# EAGLE board marbles_v70 (EAGLE 9.6.2)
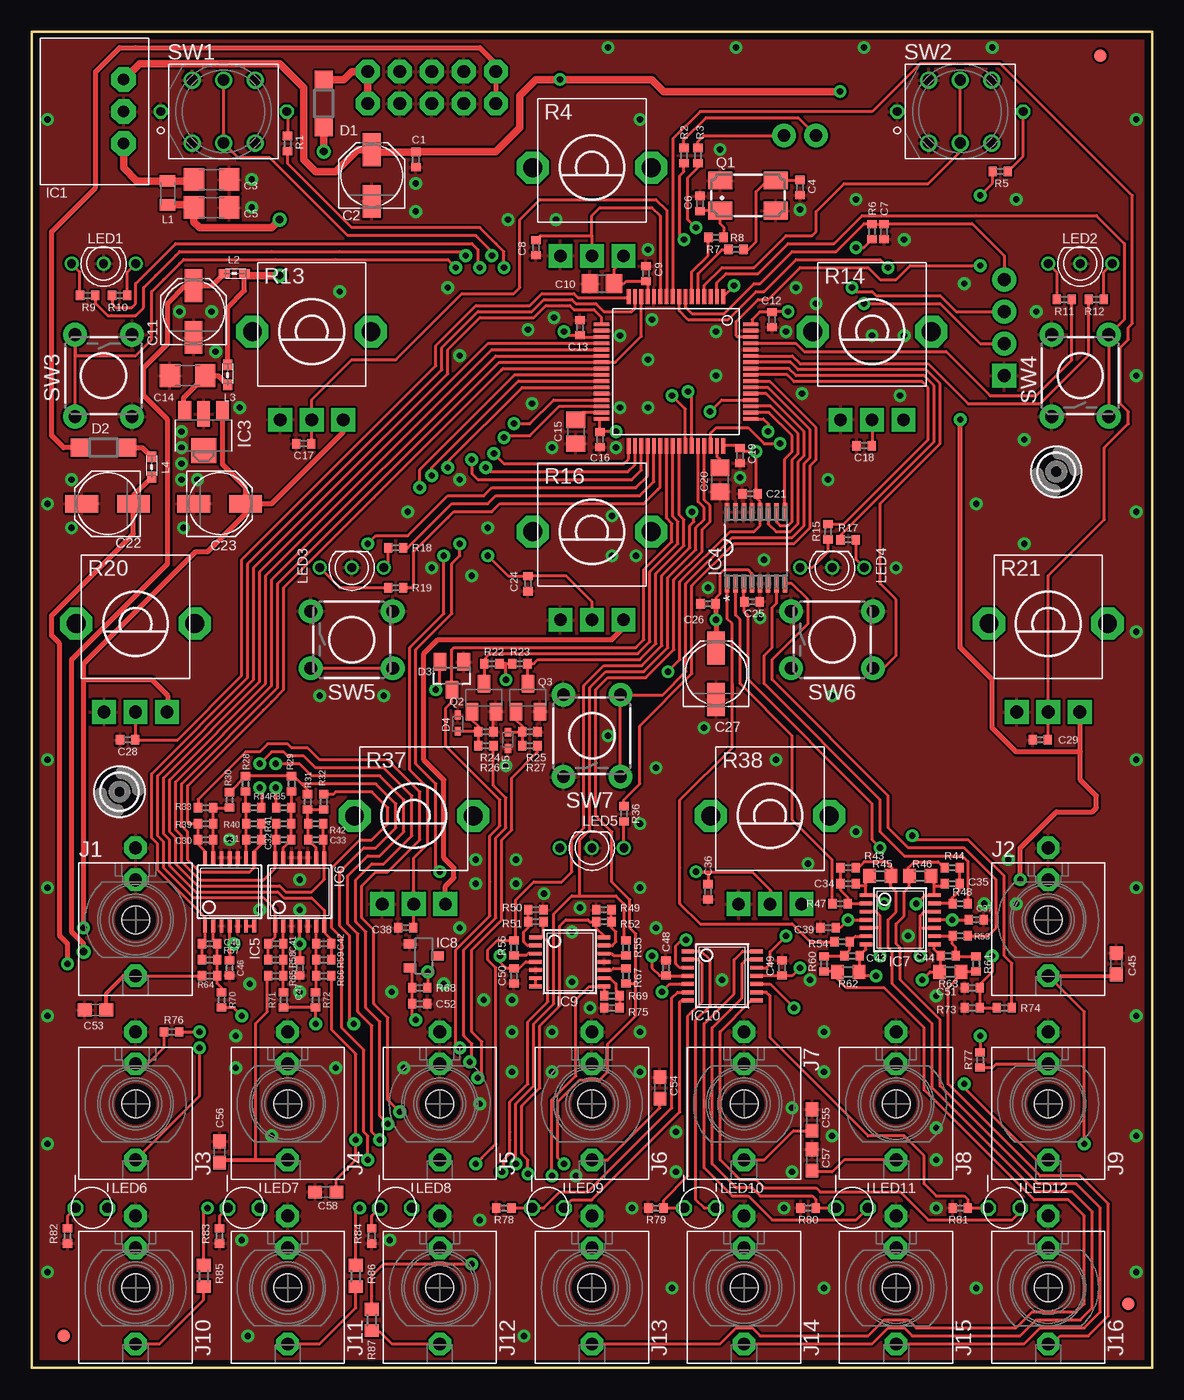
[diagram p5: board, top side]
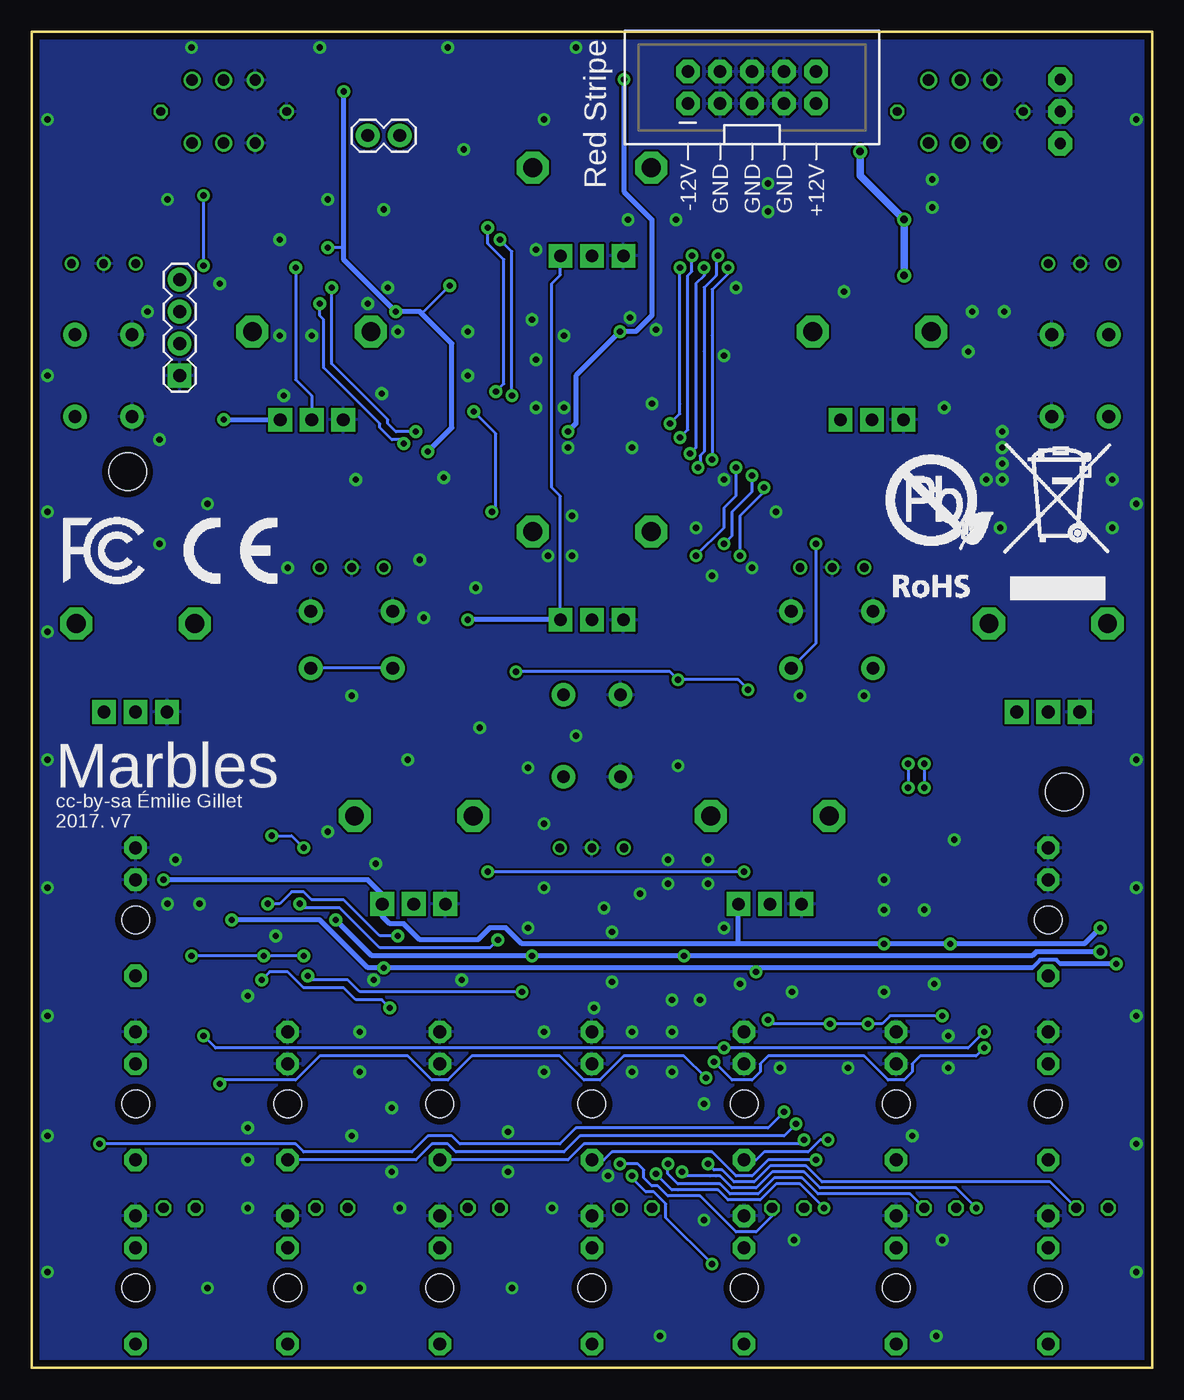
[diagram p6: board, bottom side, seen from below]

Size 88.9 x 106.05 mm. Coordinates in mm from the lower left corner, seen from the top.
Outline: 0,0 88.9,0 88.9,106.05 0,106.05 0,0
Copper layers (1*16): Top 0.035mm / dielectric 1.5mm / Bottom 0.035mm
Design rules "PCBCart-Standard-Fine": minimum track width 8mil, minimum drill 0.4mm, track to track 7mil, track to pad 7mil, pad to pad 7mil, via to via 7mil, smd to smd 7mil, copper to edge 20mil, drill to drill 8mil, minimum pad ring 8mil, minimum via ring 10mil, stop-mask expansion 3mil, vias tented up to drill 25mil, thermal gap 8mil

## Footprints (pad centres in the part's own frame; a part is rotated, then mirrored left to right if it is on the bottom)
C0402 = smd 0.65 x 0.75: 1 -0.6,0; 2 0.6,0
PANASONIC_C = smd 2.6 x 1.4: + 2.05,0; - -2.05,0
C1206 = smd 1.6 x 1.8: 1 -1.4,0; 2 1.4,0
C0805 = smd 1.3 x 1.5: 1 -0.95,0; 2 0.95,0
C0603 = smd 1.1 x 1: 1 -0.85,0; 2 0.85,0
SOD123 = smd 1.4 x 1.4: A 1.9,0; C -1.9,0
SOT23 = smd 1 x 1.4: 1 -0.95,-1.1; 2 0.95,-1.1; 3 0,1.1
SOD523 = smd 0.7 x 0.5: A 0.7,0; C -0.6,0
FIDUCIAL-1X2 = smd 1 x 1: 1 0,0
3,0TINY = hole 3: 0,0
WE78 = drill 0.9 pad 1.93 octagon: 1 -2.54,0; 2 0,0; 3 2.54,0
TQFP-10X10-64 = smd 1.2 x 0.3: 1 -5.936,3.75; 2 -5.936,3.25; 3 -5.936,2.75; 4 -5.936,2.25; 5 -5.936,1.75; 6 -5.936,1.25; 7 -5.936,0.75; 8 -5.936,0.25; 9 -5.936,-0.25; 10 -5.936,-0.75; 11 -5.936,-1.25; 12 -5.936,-1.75; 13 -5.936,-2.25; 14 -5.936,-2.75; 15 -5.936,-3.25; 16 -5.936,-3.75; 33 5.886,-3.75; 34 5.886,-3.25; 35 5.886,-2.75; 36 5.886,-2.25; 37 5.886,-1.75; 38 5.886,-1.25; 39 5.886,-0.75; 40 5.886,-0.25; 41 5.886,0.25; 42 5.886,0.75; 43 5.886,1.25; 44 5.886,1.75; 45 5.886,2.25; 46 5.886,2.75; 47 5.886,3.25; 48 5.886,3.75 | smd 0.3 x 1.2: 17 -3.75,-5.911; 18 -3.25,-5.911; 19 -2.75,-5.911; 20 -2.25,-5.911; 21 -1.75,-5.911; 22 -1.25,-5.911; 23 -0.75,-5.911; 24 -0.25,-5.911; 25 0.25,-5.911; 26 0.75,-5.911; 27 1.25,-5.911; 28 1.75,-5.911; 29 2.25,-5.911; 30 2.75,-5.911; 31 3.25,-5.911; 32 3.75,-5.911; 49 3.75,5.936; 50 3.25,5.936; 51 2.75,5.936; 52 2.25,5.936; 53 1.75,5.936; 54 1.25,5.936; 55 0.75,5.936; 56 0.25,5.936; 57 -0.25,5.936; 58 -0.75,5.936; 59 -1.25,5.936; 60 -1.75,5.936; 61 -2.25,5.936; 62 -2.75,5.936; 63 -3.25,5.936; 64 -3.75,5.936
SOT89 = smd 1 x 1.5: 1 -1.499,-1.981; 3 1.499,-1.981 | smd 1 x 2: 2 0,-1.727 | smd 2 x 2: 2@1 0,1.194
SOP65P640X110-16N = smd 1.422 x 0.356: 1 -2.845,2.286; 2 -2.845,1.626; 3 -2.845,0.965; 4 -2.845,0.33; 5 -2.845,-0.33; 6 -2.845,-0.965; 7 -2.845,-1.626; 8 -2.845,-2.286; 9 2.845,-2.286; 10 2.845,-1.626; 11 2.845,-0.965; 12 2.845,-0.33; 13 2.845,0.33; 14 2.845,0.965; 15 2.845,1.626; 16 2.845,2.286
TSSOP14_065 = smd 0.305 x 0.991: 1 -1.95,-2.718; 2 -1.3,-2.718; 3 -0.65,-2.718; 4 0,-2.718; 5 0.65,-2.718; 6 1.3,-2.718; 7 1.95,-2.718; 8 1.95,2.718; 9 1.3,2.718; 10 0.65,2.718; 11 0,2.718; 12 -0.65,2.718; 13 -1.3,2.718; 14 -1.95,2.718
DBZ_R-PDSO-G3 = smd 0.7 x 1: 1 -0.95,-1.1; 2 0.95,-1.1; 3 0,1.1
WQP_PJ_301M6 = drill 1.016 pad 1.778 octagon: P1 0,-5.715; P2 0,-3.175; P3 0,4.445 | hole 2.2: 0,0
1X04 = drill 1.016 pad 1.88 square: 1 0,0 | drill 1.016 pad 1.88: 2 2.54,0; 3 5.08,0; 4 7.62,0
1X02 = drill 1.016 pad 1.88: 1 0,0; 2 2.54,0
2X5-SHROUDED = drill 1.016 pad 1.88 octagon: 1 -1.27,5.08; 2 1.27,5.08; 3 -1.27,2.54; 4 1.27,2.54; 5 -1.27,0; 6 1.27,0; 7 -1.27,-2.54; 8 1.27,-2.54; 9 -1.27,-5.08; 10 1.27,-5.08
L2012C = smd 0.9 x 1.25: 1 -0.9,0; 2 1,0
0603 = smd 0.85 x 0.7: 1 -0.9,0; 2 0.7,0
LED-BICOLOR-THROUGHHOLE-2.54 = drill 0.7: 1 -2.54,0; 2 0,0; 3 2.54,0
LED3MM = drill 0.813 octagon: 1 -1.27,0; 2 1.27,0
CTS406 = smd 1.9 x 1.4: 1 -2.2,-1.2; 2 2.2,-1.2; 3 2.2,1.2; 4 -2.2,1.2
SOT23-BEC = smd 1 x 1.4: B -0.95,-1.1; C 0,1.1; E 0.95,-1.1
R0402 = smd 0.65 x 0.75: 1 -0.6,0; 2 0.6,0
ALPS_POT_VERTICAL_PS = drill 1 pad 1.88 square: P$1 -2.5,7; P$2 0,7; P$3 2.5,7 | drill 1.5 pad 2.54 octagon: P$4 -4.7,0; P$5 4.7,0
R0603 = smd 1 x 1.1: 1 -0.85,0; 2 0.85,0
LP4OA1PBCT = drill 0.7 octagon: L1 5,0; L2 -5,0 | drill 0.9: P1 2.5,2.5; P2 0,2.5; P3 -2.5,2.5; P4 2.5,-2.5; P5 0,-2.5; P6 -2.5,-2.5
TACTILE-PTH = drill 1.016 pad 1.88: 1 -3.251,2.261; 2 3.251,2.261; 3 -3.251,-2.261; 4 3.251,-2.261

## Placement (x,y rotation side)
C1  100n  [C0402]  30.48,95.89 270 top
C2  22u  [PANASONIC_C]  26.99,94.61 90 top
C3  22u  [C1206]  14.29,94.3 0 top
C4  20p  [C0402]  60.96,93.66 90 top
C5  22u  [C1206]  14.29,92.08 0 top
C6  20p  [C0402]  53.02,92.39 270 top
C7  100n  [C0402]  67.63,90.17 270 top
C8  100n  [C0402]  40.01,88.9 270 top
C9  100n  [C0402]  48.74,86.84 90 top
C10  2.2u  [C0805]  45.24,86.04 180 top
C11  22u  [PANASONIC_C]  12.86,83.82 90 top
C12  100n  [C0402]  58.74,83.19 270 top
C13  100n  [C0402]  43.5,82.55 90 top
C14  22u  [C1206]  12.38,78.74 180 top
C15  2.2u  [C0805]  43.18,74.3 270 top
C16  100n  [C0402]  45.09,73.66 270 top
C17  100n  [C0402]  21.59,73.34 180 top
C18  100n  [C0402]  66.04,73.18 180 top
C19  100n  [C0402]  56.2,72.39 270 top
C20  2.2u  [C0805]  54.61,70.48 270 top
C21  100n  [C0402]  56.99,69.37 180 top
C22  22u  [PANASONIC_C]  6.03,68.58 180 top
C23  22u  [PANASONIC_C]  14.92,68.58 0 top
C24  100n  [C0402]  39.37,62.23 270 top
C25  470n  [C0402]  57.15,60.8 0 top
C26  100n  [C0402]  53.66,60.64 180 top
C27  22u  [PANASONIC_C]  54.29,55.09 90 top
C28  100n  [C0402]  7.62,49.85 180 top
C29  100n  [C0402]  80.01,49.85 180 top
C30  4.7n  [C0402]  13.81,41.91 180 top
C31  470p  [C0402]  17.62,41.91 0 top
C32  4.7n  [C0402]  20,41.91 180 top
C33  4.7n  [C0402]  22.54,41.91 0 top
C34  47p  [C0402]  64.77,38.42 0 top
C35  47p  [C0402]  73.03,38.42 180 top
C36  100n  [C0402]  53.66,37.78 270 top
C37  100n  [C0402]  74.93,35.56 180 top
C38  100n  [C0402]  29.69,34.92 180 top
C39  100n  [C0402]  63.18,34.92 180 top
C40  4.7n  [C0402]  14.13,33.66 180 top
C41  470p  [C0402]  19.37,33.66 180 top
C42  4.7n  [C0402]  23.18,33.66 0 top
C43  47p  [C0402]  65.09,32.7 0 top
C44  47p  [C0402]  72.71,32.7 180 top
C45  ESD  [C0603]  86.04,32.07 90 top
C46  100n  [C0402]  15.72,31.75 270 top
C47  100n  [C0402]  21.27,31.75 270 top
C48  100n  [C0402]  50.32,31.75 90 top
C49  100n  [C0402]  59.53,31.75 270 top
C50  100n  [C0402]  38.26,31.12 270 top
C51  470n  [C0402]  74.61,30.16 180 top
C52  470n  [C0402]  30.8,28.89 0 top
C53  ESD  [C0603]  5.08,28.42 180 top
C54  ESD  [C0603]  49.85,22.23 90 top
C55  ESD  [C0603]  61.91,19.68 90 top
C56  ESD  [C0603]  14.92,17.14 90 top
C57  ESD  [C0603]  61.91,16.51 90 top
C58  ESD  [C0603]  23.34,13.97 180 top
D1  1N5819HW  [SOD123]  23.18,100.33 90 top
D2  1N5819HW  [SOD123]  5.71,73.03 0 top
D3  BAT54S  [SOT23]  33.34,54.93 180 top
D4  1N4148  [SOD523]  33.81,51.12 90 top
D5  1N4148  [SOD523]  37.78,49.85 270 top
F1  FIDUCIAL1X2  [FIDUCIAL-1X2]  84.77,104.14 0 top
F2  FIDUCIAL1X2  [FIDUCIAL-1X2]  87,5.08 0 top
F3  FIDUCIAL1X2  [FIDUCIAL-1X2]  2.54,2.54 0 top
H3  MOUNT-HOLE3.0TINY  [3,0TINY]  81.28,71.12 0 top
H5  MOUNT-HOLE3.0TINY  [3,0TINY]  6.99,45.72 0 top
IC1  R-78E3.3-0.5  [WE78]  7.3,99.69 90 top
IC2  STM32F405RGT6  [TQFP-10X10-64]  51.12,79.06 270 top
IC3  LD2981ABU33  [SOT89]  13.65,73.98 180 top
IC4  DAC8164ICPW  [SOP65P640X110-16N]  57.47,65.09 90 top
IC5  MCP6004  [TSSOP14_065]  15.72,37.78 0 top
IC6  MCP6004  [TSSOP14_065]  21.27,37.78 0 top
IC7  OPA4171  [TSSOP14_065]  68.9,35.56 270 top
IC8  LM4040B10  [DBZ_R-PDSO-G3]  31.11,32.7 270 top
IC9  LM324PW  [TSSOP14_065]  42.7,32.23 270 top
IC10  TL074PW  [TSSOP14_065]  54.77,31.11 270 top
J1  PJ301_THONKICONN6  [WQP_PJ_301M6]  8.26,35.56 180 top
J2  PJ301_THONKICONN6  [WQP_PJ_301M6]  80.64,35.56 180 top
J3  PJ301_THONKICONN6  [WQP_PJ_301M6]  8.26,20.95 180 top
J4  PJ301_THONKICONN6  [WQP_PJ_301M6]  20.32,20.95 180 top
J5  PJ301_THONKICONN6  [WQP_PJ_301M6]  32.38,20.95 180 top
J6  PJ301_THONKICONN6  [WQP_PJ_301M6]  44.45,20.95 180 top
J7  PJ301_THONKICONN6  [WQP_PJ_301M6]  56.52,20.95 180 top
J8  PJ301_THONKICONN6  [WQP_PJ_301M6]  68.58,20.95 180 top
J9  PJ301_THONKICONN6  [WQP_PJ_301M6]  80.64,20.95 180 top
J10  PJ301_THONKICONN6  [WQP_PJ_301M6]  8.26,6.35 180 top
J11  PJ301_THONKICONN6  [WQP_PJ_301M6]  20.32,6.35 180 top
J12  PJ301_THONKICONN6  [WQP_PJ_301M6]  32.38,6.35 180 top
J13  PJ301_THONKICONN6  [WQP_PJ_301M6]  44.45,6.35 180 top
J14  PJ301_THONKICONN6  [WQP_PJ_301M6]  56.52,6.35 180 top
J15  PJ301_THONKICONN6  [WQP_PJ_301M6]  68.58,6.35 180 top
J16  PJ301_THONKICONN6  [WQP_PJ_301M6]  80.64,6.35 180 top
JP1  [1X04]  77.15,78.74 90 bottom
JP2  [1X02]  59.69,97.79 180 bottom
JP4  M05X2SHD  [2X5-SHROUDED]  31.75,101.6 90 bottom
L1  33u  [L2012C]  10.79,93.19 90 top
L2  [0603]  16.19,86.84 0 top
L3  [0603]  15.56,78.9 90 top
L4  [0603]  9.53,71.6 90 top
LED1  W115WSURKMGKW  [LED-BICOLOR-THROUGHHOLE-2.54]  5.71,87.63 180 top
LED2  W115WSURKMGKW  [LED-BICOLOR-THROUGHHOLE-2.54]  83.19,87.63 180 top
LED3  W115WSURKMGKW  [LED-BICOLOR-THROUGHHOLE-2.54]  25.4,63.5 180 top
LED4  W115WSURKMGKW  [LED-BICOLOR-THROUGHHOLE-2.54]  63.5,63.5 180 top
LED5  W115WSURKMGKW  [LED-BICOLOR-THROUGHHOLE-2.54]  44.45,41.27 180 top
LED6  WP937EGW  [LED3MM]  4.76,12.7 180 top
LED7  WP937EGW  [LED3MM]  16.83,12.7 180 top
LED8  WP937EGW  [LED3MM]  28.89,12.7 180 top
LED9  WP937EGW  [LED3MM]  40.96,12.7 180 top
LED10  WP937EGW  [LED3MM]  53.02,12.7 180 top
LED11  WP937EGW  [LED3MM]  65.09,12.7 180 top
LED12  WP937EGW  [LED3MM]  77.15,12.7 180 top
Q1  8MHz  [CTS406]  56.83,93.03 0 top
Q2  MMBT3904  [SOT23-BEC]  35.88,53.18 0 top
Q3  MMBT3904  [SOT23-BEC]  39.37,53.18 0 top
R1  39  [R0402]  20.32,97.16 90 top
R2  100  [R0402]  51.75,96.2 270 top
R3  100  [R0402]  52.86,96.2 270 top
R4  10kB  [ALPS_POT_VERTICAL_PS]  44.45,95.25 180 top
R5  39  [R0402]  76.83,94.93 0 top
R6  10k  [R0402]  66.67,90.17 270 top
R7  100  [R0402]  54.29,89.69 0 top
R8  100  [R0402]  55.88,88.74 0 top
R9  2.2k  [R0402]  4.45,85.09 180 top
R10  1.5k  [R0402]  6.99,85.09 0 top
R11  2.2k  [R0402]  81.92,84.77 180 top
R12  1.5k  [R0402]  84.45,84.77 0 top
R13  10kB  [ALPS_POT_VERTICAL_PS]  22.23,82.23 180 top
R14  10kB  [ALPS_POT_VERTICAL_PS]  66.67,82.23 180 top
R15  2.2k  [R0402]  63.18,66.36 270 top
R16  10kB  [ALPS_POT_VERTICAL_PS]  44.45,66.36 180 top
R17  1.5k  [R0402]  64.77,65.72 0 top
R18  1.5k  [R0402]  28.89,65.09 180 top
R19  2.2k  [R0402]  28.89,61.91 180 top
R20  10kB  [ALPS_POT_VERTICAL_PS]  8.26,59.05 180 top
R21  10kB  [ALPS_POT_VERTICAL_PS]  80.64,59.05 180 top
R22  10k  [R0402]  36.51,55.88 0 top
R23  10k  [R0402]  38.74,55.88 180 top
R24  100k  [R0402]  36.04,50.48 180 top
R25  100k  [R0402]  39.53,50.48 180 top
R26  100k  [R0402]  36.04,49.37 180 top
R27  100k  [R0402]  39.53,49.37 180 top
R28  200k  [R0402]  16.99,46.35 90 top
R29  200k  [R0402]  20.64,46.35 90 top
R30  200k  [R0402]  15.72,45.09 90 top
R31  200k  [R0402]  21.91,44.93 90 top
R32  100k  [R0402]  23.18,44.93 90 top
R33  100k  [R0402]  13.81,44.45 180 top
R34  100k  [R0402]  17.62,44.45 0 top
R35  100k  [R0402]  20,44.45 180 top
R36  1.5k  [R0402]  46.99,43.97 270 top
R37  10kB  [ALPS_POT_VERTICAL_PS]  30.32,43.81 180 top
R38  10kB  [ALPS_POT_VERTICAL_PS]  58.58,43.81 180 top
R39  33k  [R0402]  13.81,43.18 0 top
R40  33k  [R0402]  17.62,43.18 180 top
R41  33k  [R0402]  20,43.18 0 top
R42  33k  [R0402]  22.54,43.18 180 top
R43  100k  [R0402]  64.77,39.69 180 top
R44  100k  [R0402]  73.02,39.69 0 top
R45  1.0k  [R0603]  67.31,39.05 180 top
R46  1.0k  [R0603]  70.48,39.05 0 top
R47  23.7k  [R0402]  64.14,36.83 180 top
R48  23.7k  [R0402]  73.66,36.83 0 top
R49  39k  [R0402]  45.4,36.35 180 top
R50  39k  [R0402]  40.01,36.35 0 top
R51  56k  [R0402]  40.01,35.4 180 top
R52  56k  [R0402]  45.4,35.4 0 top
R53  23.7k  [R0402]  73.66,34.29 0 top
R54  23.7k  [R0402]  64.29,33.81 180 top
R55  10k  [R0402]  47.15,33.34 90 top
R56  10k  [R0402]  38.26,33.34 90 top
R57  33k  [R0402]  14.13,32.38 0 top
R58  33k  [R0402]  19.37,32.38 0 top
R59  33k  [R0402]  23.18,32.38 180 top
R60  100k  [R0402]  62.87,32.07 90 top
R61  100k  [R0402]  74.93,32.07 90 top
R62  1.0k  [R0603]  64.77,31.43 0 top
R63  1.0k  [R0603]  72.87,31.43 180 top
R64  100k  [R0402]  14.13,31.11 180 top
R65  100k  [R0402]  19.37,31.11 180 top
R66  100k  [R0402]  23.18,31.11 0 top
R67  10k  [R0402]  47.15,31.11 270 top
R68  1.0k  [R0402]  30.8,30.16 180 top
R69  56k  [R0402]  46.04,29.53 0 top
R70  200k  [R0402]  15.08,29.21 270 top
R71  200k  [R0402]  20,29.21 270 top
R72  200k  [R0402]  22.54,29.21 270 top
R73  100k  [R0402]  74.61,28.57 0 top
R74  150k  [R0402]  77.15,28.57 0 top
R75  39k  [R0402]  46.04,28.57 180 top
R76  100k  [R0402]  11.11,26.67 180 top
R77  100k  [R0402]  75.25,24.45 270 top
R78  680  [R0402]  37.47,12.7 180 top
R79  680  [R0402]  49.53,12.7 180 top
R80  680  [R0402]  61.59,12.7 180 top
R81  680  [R0402]  73.66,12.7 180 top
R82  180  [R0402]  2.86,10.48 90 top
R83  180  [R0402]  14.92,10.48 90 top
R84  180  [R0402]  26.99,10.48 90 top
R85  1.0k  [R0603]  13.65,7.3 90 top
R86  1.0k  [R0603]  25.72,7.3 90 top
R87  1.0k  [R0603]  26.99,3.81 90 top
SW1  LP4OA1PBCT  [LP4OA1PBCT]  15.24,99.69 0 top
SW2  LP4OA1PBCT  [LP4OA1PBCT]  73.66,99.69 0 top
SW3  [TACTILE-PTH]  5.71,78.74 270 top
SW4  [TACTILE-PTH]  83.19,78.74 90 top
SW5  [TACTILE-PTH]  25.4,57.78 0 top
SW6  [TACTILE-PTH]  63.5,57.78 0 top
SW7  [TACTILE-PTH]  44.45,50.16 90 top
U$2  [ROHS_BIG]  22.38,60.17 0 bottom
U$4  [CE_MEDIUM]  76.83,62.23 0 bottom
U$5  [FCC_MEDIUM]  86.36,62.23 0 bottom

## Tracks (layer width: path | path; a pad name or v marks a point on that pad's centre or on a via)
+3V3  (via drill 0.5)
  Top 0.254: IC2.64 57.15,82.9 57.15,83.19 57.75,83.78 C12.1 58.77,83.82 v60.01,83.82 | v46.35,74.3 45.12,74.3 C16.1 45.09,75.19 IC2.32 | IC2.1 55.72,85.85 v55.72,85.88 | R6.2 66,88.9 v65.41,88.9 | IC2.48 56.02,73.17 C19.1 56.48,72.71 v57.47,72.71 57.47,69.5 C21.1 57.59,68.93 57.78,68.74 57.78,67.94 IC4.12 57.8,66.85 57.31,66.36 55.4,66.36 51.44,62.39 51.44,56.2 v50.48,55.24 | v50.48,55.24 | R22.2 37.62,55.88 | v32.07,53.82 32.39,54.14 D3.2 | v37.62,54.61 37.62,55.88 | R23.2 | 37.62,55.88 R23.2 | IC2.19 43.64,81.81 C13.1 42.51,81.95 v42.23,82.23
  Top 0.61: v41.91,102.23 49.21,102.23 50.16,101.28 v64.14,101.28 | v41.91,102.23 41.88,102.2 | IC1.3 8.57,103.5 19.68,103.5 21.59,101.6 21.59,95.89 22.54,94.93 24.13,94.93 25.86,96.67 C2.+ 27.17,96.48 C1.1 30.52,96.52 36.83,96.52 38.73,98.42 38.73,100.97 40.01,102.23 v41.91,102.23
  Bottom 0.254: v55.72,85.88 57.78,83.82 v60.01,83.82 | 64.14,88.9 v65.41,88.9 | v32.07,53.82 32.86,54.61 v37.62,54.61 38.26,55.24 v50.48,55.24
  Bottom 0.406: v57.47,72.71 55.56,74.61 55.56,81.28 58.1,83.82 v60.01,83.82 64.14,87.95 64.14,88.9 v64.14,101.28 | v41.91,102.23 41.91,93.34 39.69,91.12 39.69,83.5 40.96,82.23 v42.23,82.23 45.72,78.74 45.72,74.93 v46.35,74.3
+3V3_A  (via drill 0.5)
  Top 0.254: C47.1 v21.27,33.66 IC6.4 | C26.1 54.29,60.68 54.29,61.12 54.61,61.44 54.61,63.02 54.93,63.34 56.83,63.34 57.14,63.04 IC4.4 | R4.P$1 46.95,87.91 46.19,87.15 C10.1 46.99,86.04 47.18,86.24 C9.1 48.87,86.11 IC2.13 | IC5.4 15.72,33.97 v16.03,33.66 15.72,33.34 C46.1
  Top 0.406: v78.42,38.73 78.42,41.27 81.28,44.13 84.14,44.13 84.45,44.45 84.45,45.4 83.19,46.67 83.19,48.9 | v4.13,34.92 4.13,54.61 | R13.P$1 24.73,74.25 19.05,68.58 C23.+ | 4.13,54.61 4.13,55.88 13.02,64.77 13.97,64.77 16.97,67.77 C23.+ | R20.P$1 10.79,52.09 10.79,53.34 9.53,54.61 4.13,54.61 | C26.1 54.29,60.61 v54.29,59.37 C27.+ | R16.P$1 46.95,58.78 46.99,58.74 46.04,57.78 32.23,57.78 31.11,56.67 31.11,48.26 32.7,46.67 32.7,40.48 33.5,39.69 33.5,38.89 32.82,38.22 R37.P$1 | v73.66,75.25 73.66,57.15 76.2,54.61 76.2,50.8 78.11,48.9 83.19,48.9 | R21.P$1 83.19,52.05 83.19,48.9 | C23.+ 16.99,68.58 16.99,69.85 16.35,70.48 15.15,71.69 IC3.1
  Bottom 0.254: R16.P$1 46.95,69.17 47.62,69.85 47.62,86.04 46.95,86.72 R4.P$1
  Bottom 0.406: v4.13,34.92 5.4,33.66 v16.03,33.66 v21.27,33.66 32.86,33.66 | R37.P$1 32.86,36.77 32.86,33.66 | R14.P$1 69.19,75.25 v73.66,75.25 | 32.86,33.66 50.01,33.66 51.28,34.92 52.55,34.92 53.5,33.97 58.1,33.97 59.37,35.24 60.48,35.24 61.08,35.84 R38.P$1 61.08,37.58 62.23,38.73 v78.42,38.73 | 46.97,59.37 R16.P$1 46.97,59.37 v54.29,59.37
ADC_DV_CV
  Top 0.254: IC2.21 36.52,80.81 18.57,62.87 18.57,54.29 10.95,46.67 10.95,42.55 11.43,42.07 11.43,40.01 13.18,38.26 19.68,38.26 20.16,37.78 22.23,37.78 23.18,38.73 23.22,38.78 IC6.8 23.22,41.83 23.18,41.88 C33.2 R42.1
ADC_DV_POT
  Top 0.254: 44.47,88.27 R4.P$2 44.45,89.85 | 44.45,89.85 44.45,91.44 45.09,92.08 49.21,92.08 49.87,91.42 IC2.11 | C8.1 40.36,89.85 44.45,89.85
ADC_LENGTH_POT  (via drill 0.5)
  Top 0.254: IC2.27 38.91,77.81 33.02,71.91 v33.02,71.44 | v36.2,64.45 37.82,62.83 C24.1 39.41,62.87 42.39,62.87 44.45,60.8 R16.P$2
  Bottom 0.254: v33.02,71.44 33.02,69.22 33.97,68.26 33.97,66.67 v36.2,64.45
ADC_T_BIAS_CV
  Top 0.254: IC2.15 47.87,84.06 47.62,83.82 45.4,83.82 44.77,84.45 43.18,84.45 42.86,84.77 40.64,84.77 40.16,84.3 39.69,83.82 35.4,83.82 32.54,80.96 32.54,79.22 25.24,71.91 17.14,63.82 17.14,54.77 9.53,47.15 9.53,42.07 10,41.59 | R57.1 C40.2 13.77,33.89 13.77,34.45 | 10,41.59 10,39.53 13.77,35.76 13.77,34.45 | 10,41.59 | 13.77,34.45 IC5.1
ADC_T_BIAS_POT
  Top 0.254: R20.P$2 8.26,49.88 C28.1 11.59,49.85 16.67,54.93 16.67,64.14 32.07,79.53 32.07,81.12 35.24,84.3 39.53,84.3 40.48,85.25 43.02,85.25 43.34,84.93 47.31,84.93 IC2.16
ADC_T_JITTER_CV
  Top 0.254: IC2.20 36.22,81.31 18.1,63.18 18.1,54.45 10.48,46.83 10.48,42.39 10.95,41.91 | R59.1 C42.2 23.78,34.01 23.22,34.56 IC6.7 23.22,36.31 23.18,36.35 22.23,37.31 20,37.31 19.53,37.78 13.02,37.78 10.95,39.85 10.95,41.91 | 10.95,41.91
ADC_T_JITTER_POT  (via drill 0.5)
  Top 0.254: IC2.25 38.33,78.81 30.8,71.28 v30.8,69.85 | C38.1 30.32,34.96 R37.P$2 30.32,40.48 | 30.32,40.48 31.43,41.59 31.43,46.04 30,47.47 | v32.7,64.45 32.7,59.85 30,57.15 30,47.47 | 30.32,40.48 | 30,47.47
  Bottom 0.254: v30.8,69.85 30.8,69.53 32.7,67.63 v32.7,64.45
ADC_T_RATE_CV
  Top 0.254: R58.1 C41.2 19.32,34.21 IC6.1 19.32,36.4 18.41,37.31 12.86,37.31 10.48,39.69 10.48,41.75 10,42.23 10,46.99 17.62,54.61 17.62,63.5 33.02,78.9 33.02,80.8 35.56,83.34 39.85,83.34 40.32,83.82 40.8,84.3 42.07,84.3 42.7,84.3 43.02,83.98 44.61,83.98 45.21,83.38 IC2.17
ADC_T_RATE_POT
  Top 0.254: R13.P$2 22.23,76.2 | C17.1 22.23,73.38 R13.P$2 | IC2.10 50.37,91.87 49.53,92.71 40.32,92.71 38.73,91.12 38.73,85.72 38.26,85.25 34.13,85.25 | 34.13,85.25 | 34.13,85.25 28.89,80.01 25.4,80.01 22.23,76.83 R13.P$2
ADC_X_BIAS_CV
  Top 0.254: IC2.24 37.4,79.31 37.26,79.17 27.15,69.06 20,61.91 20,53.82 19.05,52.86 18.41,52.23 12.38,46.2 12.38,43.34 12.54,43.18 R39.1 C30.2 13.18,41.88 13.18,41.59 13.77,41 IC5.14
ADC_X_BIAS_POT
  Top 0.254: IC2.9 50.87,97.54 53.02,99.69 66.67,99.69 70.48,103.5 76.83,103.5 87.31,93.03 87.31,82.87 87,82.55 87,81.6 86.36,80.96 86.36,76.52 87,75.88 87,74.93 85.09,73.03 85.09,67.31 80.64,62.87 R21.P$2 80.64,49.88 C29.1
ADC_X_SPREAD_CV
  Top 0.254: R40.1 C31.2 18.26,41.88 18.26,41.59 17.67,41 IC5.8 17.67,39.73 17.3,39.37 13.34,39.37 12.38,40.32 12.38,42.55 11.91,43.02 11.91,46.35 19.53,53.98 19.53,62.23 37.1,79.81 IC2.23 46.31,79.81 48.37,81.86 IC2.14
ADC_X_SPREAD_POT  (via drill 0.5)
  Top 0.254: IC2.8 51.37,83.89 52.07,83.19 55.24,83.19 57.47,85.41 58.1,85.41 60.64,87.95 67.31,87.95 v67.94,87.31 | C18.1 66.67,73.22 R14.P$2
  Bottom 0.254: v67.94,87.31 67.94,78.42 66.67,77.15 R14.P$2
ADC_X_STEPS_CV
  Top 0.254: R41.1 C32.2 19.37,41.88 19.32,41.83 IC6.14 19.32,39.64 18.41,38.73 13.34,38.73 11.91,40.16 11.91,42.23 | IC2.22 36.81,80.31 19.05,62.55 19.05,54.13 11.43,46.51 11.43,42.7 11.91,42.23 | 11.91,42.23 | 11.91,42.23
ADC_X_STEPS_POT  (via drill 0.5)
  Top 0.254: IC2.26 38.62,78.31 31.75,71.44 v31.75,70.8 | v33.97,65.41 33.97,64.45 33.34,63.82 33.34,59.85 30.48,56.99 30.48,47.94 32.07,46.35 32.07,39.69 v32.38,39.37 | v52.7,39.37 53.66,39.37 | 53.66,39.37 57.15,39.37 58.58,37.94 R38.P$2 | 53.66,39.37 C36.1
  Bottom 0.254: v31.75,70.8 31.75,69.53 33.34,67.94 33.34,66.04 v33.97,65.41 | v32.38,39.37 v52.7,39.37
AREF_-10  (via drill 0.5)
  Top 0.254: R71.2 R72.2 v22.54,27.3 | R30.2 R28.2 R29.2 20.76,46.83 20.95,46.83 21.43,46.35 | v25.56,27.3 25.24,27.62 25.24,34.29 24.45,35.08 24.45,39.37 26.35,41.27 27.3,41.27 28.89,42.86 28.89,44.77 27.3,46.35 21.43,46.35 | v30.48,27.62 30.2,27.91 C52.1 R68.2 30.2,31.57 IC8.2 | v16.67,27.94 16,28.61 R70.2 | 21.43,46.35 21.91,45.88 R31.2
  Bottom 0.254: v16.67,27.94 20.8,27.94 21.43,27.3 v22.54,27.3 v25.56,27.3 30.16,27.3 v30.48,27.62
DAC_MOSI
  Top 0.254: IC2.53 58.27,77.31 61.28,74.3 61.28,72.39 60.8,71.91 60.8,66.99 60.17,66.36 59.05,66.36 58.43,66.98 IC4.11
DAC_SCK
  Top 0.254: IC2.51 58.63,76.31 60.8,74.14 60.8,72.55 60.33,72.07 60.33,67.15 60.01,66.83 59.37,66.83 59.09,67.11 IC4.10
DAC_SS
  Top 0.254: IC2.50 58.49,75.81 60.33,73.98 60.33,72.71 59.75,72.14 IC4.9
DAC_X_1
  Top 0.254: R47.2 63.5,36.87 63.5,40.32 60.33,43.5 60.33,50.16 56.2,54.29 56.2,59.37 55.84,59.73 IC4.2
DAC_X_2
  Top 0.254: R48.2 74.26,40.2 73.82,40.64 69.22,40.64 67.31,42.55 67.31,45.09 58.1,54.29 58.1,56.52 58.74,57.15 58.74,60.33 59.09,60.68 IC4.7
DAC_X_3
  Top 0.254: R53.2 75.88,34.29 76.52,34.92 76.52,38.73 73.98,41.27 69.53,41.27 67.94,42.86 67.94,45.4 58.74,54.61 58.74,56.2 61.59,59.05 61.59,59.37 61.59,60.96 60.31,62.24 IC4.8
DAC_Y
  Top 0.254: IC4.1 55.18,59.44 55.56,59.05 55.56,54.29 | R54.2 | R54.2 61.75,33.81 60.33,35.24 53.02,35.24 51.44,36.83 51.44,39.69 51.44,45.09 55.56,49.21 55.56,54.29 | 55.56,54.29 55.56,53.34
DEPRECATED
  Top 0.254: IC5.6 IC5.7
GATE_T_1  (via drill 0.5)
  Top 0.254: v52.39,67.94 52.55,67.79 52.55,67.15 52.23,66.83 52.23,65.09 50.01,62.87 50.01,57.31 48.42,55.72 45.4,55.72 43.81,54.13 43.81,42.86 42.86,41.91 42.86,39.37 42.07,38.58 39.85,38.58 38.42,37.15 38.42,34.1 R56.2 | v35.24,16.19 35.72,16.67 36.51,17.46 36.83,17.78 36.83,31.75 36.2,32.38 36.2,33.18 36.95,33.94 R56.2 | R56.2 38.22,33.97 | R56.2 38.1,34.1 | v53.82,75.88 54.74,76.81 IC2.52
  Bottom 0.254: v53.82,75.88 52.07,74.14 52.07,68.26 v52.39,67.94 | LED6.1 8.1,14.76 26.19,14.76 27.46,16.03 30.32,16.03 31.59,14.76 33.18,14.76 34.13,15.72 34.77,15.72 v35.24,16.19
GATE_T_2  (via drill 0.5)
  Top 0.254: IC2.44 52.87,68.73 53.34,68.26 53.34,67.31 52.7,66.67 52.7,64.93 50.48,62.71 50.48,57.15 48.58,55.24 45.56,55.24 44.29,53.98 44.29,42.7 43.5,41.91 43.5,37.47 | v38.42,16.19 38.42,20.95 39.85,22.38 39.85,27.3 41.43,28.89 41.43,36.04 42.86,37.47 43.5,37.47 | R55.2 46.99,34.1 46.99,36.83 46.35,37.47 43.5,37.47
  Bottom 0.254: LED7.1 19.21,13.81 26.51,13.81 27.78,15.08 30,15.08 31.27,13.81 33.5,13.81 34.29,14.61 37.62,14.61 38.42,15.4 v38.42,16.19
GATE_T_3  (via drill 0.5)
  Top 0.254: v42.23,16.19 41.75,16.67 41.75,21.11 43.5,22.86 45.09,22.86 45.72,23.5 45.72,25.72 47.94,27.94 47.94,30.48 | IC2.45 53.37,68.87 53.82,68.42 53.82,67.15 53.37,66.7 53.18,66.52 53.18,64.77 50.96,62.55 50.96,56.99 48.74,54.77 45.72,54.77 44.77,53.82 44.77,43.81 46.04,42.55 46.04,38.58 47.47,37.15 47.47,34.92 47.94,34.45 47.94,30.48 | R67.2 47.18,30.48 47.94,30.48
  Bottom 0.254: LED8.1 30.16,12.06 31.43,10.79 33.02,10.79 35.88,13.65 38.42,13.65 39.21,14.45 39.69,14.45 40.32,15.08 40.32,15.72 40.8,16.19 v42.23,16.19
GND  (via drill 0.5)
  Top 0.254: Q2.E 36.64,51.89 R24.1
  other vias: 63.18,70.48 62.23,84.45 75.56,36.83 41.59,91.12 17.3,30.48 21.27,29.84 15.72,41.91 21.27,38.73 21.27,36.35 41.43,83.34 30.48,91.76 30.48,93.98 60.96,91.92 35.56,11.75 47.62,12.7 59.69,12.7 71.75,12.7 61.75,30.8 46.35,73.03 33.97,34.92 32.7,30.48 38.1,29.21 48.26,23.5 29.53,23.81 24.13,23.81 28.42,10.16 16.67,10.16 62.87,26.67 62.87,23.5 60.33,20.64 60.33,15.56 51.12,18.73 51.12,15.56 49.53,34.92 49.53,47.62 58.1,64.14 61.59,40.01 78.11,36.83 77.47,40.32 46.67,81.92 39.69,76.52 39.37,82.39 24.45,85.41 33.02,85.72 37.78,91.12 29.84,67.94 46.67,76.2 49.21,83.19 65.41,92.71 47.94,64.45 46.04,64.45 60.64,85.72 69.22,89.53 1.27,7.62 1.27,17.78 1.27,27.94 1.27,38.1 1.27,48.26 45.72,104.78 87.63,7.62 87.63,18.41 87.63,27.94 87.63,38.1 87.63,58.42 87.63,67.94 87.63,78.74 22.86,53.34 59.05,48.26 48.26,99.06 74.93,68.58 78.74,65.41 39.05,2.54 17.14,2.54 50.8,6.35 62.87,6.35 74.93,6.35 48.9,80.01 54.29,78.74 48.9,76.2 54.29,82.23 41.27,73.03 16.19,26.35 16.19,23.81 54.77,30.8 69.53,34.29 71.75,29.53 78.11,92.71 79.69,83.82 37.62,47.78 46.04,67.63 19.05,18.41 66.67,81.92 69.22,81.92 48.26,38.1 48.9,88.74 87.63,48.26 59.85,82.23 54.61,96.68 63.5,18.41 71.75,19.05 71.75,16.51 35.56,20.95 68.9,77.15 73.98,86.04 56.2,70.64 48.26,26.67 44.29,28.57 42.86,30.64 43.5,36.51 40.64,37.62 42.86,34.61 35.88,29.21 41.27,23.5 41.27,26.67 38.1,26.67 38.1,23.5 17.46,94.3 17.46,92.08 27.94,53.34 78.74,73.66 43.18,15.24 11.75,83.82 14.29,83.82 14.61,80.64 11.91,70.48 12.06,66.67 3.17,70.48 3.17,66.67 1.27,68.58 33.97,80.33 53.66,61.91 53.34,50.8 36.2,66.67 34.92,62.87 31.75,63.5 33.97,70.48 57.78,59.53 18.1,36.35 38.42,38.42 38.42,40.32 35.24,40.32 35.24,38.42 28.57,29.84 68.58,63.5 63.5,53.34 65.41,42.55 48.26,43.18 45.72,50.16 61.12,77.31 55.88,104.78 66.04,104.78 76.2,104.78 87.63,99.06 1.27,99.06 11.91,74.3 11.91,73.03 11.91,71.76 13.18,70.48 16.51,76.2
  pour Bottom: 0,106.05 0,0 88.9,0 88.9,106.05
  pour Top: 0,106.05 88.9,106.05 88.9,0 0,0
LED_T_DV  (via drill 0.5)
  Top 0.254: v37.47,87.31 37.47,88.27 37.47,88.58 36.83,89.22 35.56,90.49 25.4,90.49 20.32,95.57 R1.1 | v38.26,74.93 39.53,74.93 41.41,76.81 IC2.29
  Bottom 0.254: v38.26,74.93 37.47,75.72 37.47,76.52 v37.47,87.31
LED_T_MODE_G  (via drill 0.5)
  Top 0.254: IC2.33 47.37,72.13 46.99,71.75 37.47,71.75 v36.67,72.55 | v35.56,87.31 35.4,87.47 35.4,88.74 34.92,89.22 11.43,89.22 8.26,86.04 8.26,84.45 7.94,84.14 6.67,84.14 6.38,84.42 R10.1
  Bottom 0.254: v36.67,72.55 36.2,73.03 36.2,86.04 35.56,86.68 v35.56,87.31
LED_T_MODE_R  (via drill 0.5)
  Top 0.254: IC2.34 47.87,71.68 47.31,71.12 36.35,71.12 v36.04,71.44 | v34.45,88.27 34.45,88.42 34.29,88.58 24.45,88.58 19.05,88.58 11.75,88.58 11.43,88.27 9.84,86.68 8.89,85.72 8.89,84.14 8.26,83.5 6.03,83.5 | 6.03,83.5 6.35,83.5 | 6.03,83.5 5.04,84.49 R9.1
  Bottom 0.254: v36.04,71.44 35.88,71.6 35.88,72.39 35.56,72.71 35.56,80.64 35.56,85.72 34.61,86.68 34.61,88.11 v34.45,88.27
LED_T_RANGE_G
  Top 0.254: 29.84,65.09 | R18.1 29.84,65.09 | 29.84,65.09 33.34,68.58 36.2,68.58 36.83,69.22 48.26,69.22 49.37,70.32 IC2.37
LED_T_RANGE_R
  Top 0.254: 33.5,67.94 33.02,67.47 30.32,64.77 30.32,62.07 30.16,61.91 R19.1 | 33.5,67.94 | 33.5,67.94 36.51,67.94 37.15,68.58 48.58,68.58 49.69,69.69 49.87,69.87 IC2.38
LED_X_DV  (via drill 0.5)
  Top 0.254: IC2.62 55.99,81.81 55.88,81.92 55.88,83.03 57.63,84.77 58.42,84.77 60.96,87.31 66.36,87.31 67.31,86.36 68.58,86.36 69.69,87.47 v75.25,87.47 | v75.25,93.03 76.23,94.02 R5.1
  Bottom 0.254: v75.25,87.47 v75.25,93.03
LED_X_EXT_G
  Top 0.254: IC2.55 57.1,78.26 58.58,78.26 62.23,74.61 62.23,72.07 61.75,71.6 61.75,66.67 60.48,65.41 55.72,65.41 52.39,62.07 52.39,55.09 48.26,50.96 48.26,46.35 46.99,45.09 R36.1
LED_X_MODE_G
  Top 0.254: IC2.59 60.34,80.31 60.96,79.69 71.12,79.69 74.3,76.52 80.01,76.52 83.86,80.36 R12.1
LED_X_MODE_R
  Top 0.254: IC2.61 60.62,81.31 61.28,80.64 72.55,80.64 76.04,77.15 79.69,77.15 82.52,79.97 R11.1
LED_X_RANGE_G
  Top 0.254: IC2.57 60.08,79.31 60.64,78.74 70.8,78.74 71.6,77.95 71.6,73.5 64.17,66.08 R17.1
LED_X_RANGE_R
  Top 0.254: IC2.56 59.94,78.81 60.48,78.26 70.64,78.26 71.12,77.79 71.12,73.66 64.45,66.99 64.42,66.96 R15.1
MORPH_IN
  Top 0.254: J1.P3 R64.2
  Top 0.305: J1.P3 7.3,31.11 5.93,29.74 C53.1
MORPH_IN1  (via drill 0.5)
  Top 0.254: v27.62,18.1 26.99,18.73 26.99,27.15 25.88,28.26 25.88,34.45 25.08,35.24 25.08,39.05 26.67,40.64 27.62,40.64 29.53,42.55 29.53,45.09 27.62,46.99 22.23,46.99 21.27,47.94 v19.37,47.94 | R35.2 19.37,44.48 v19.37,46.04 | J7.P3 58.1,16.51 60.43,18.84 C55.1
  Bottom 0.254: J7.P3 46.35,16.51 45.09,17.78 27.94,17.78 v27.62,18.1 | v19.37,47.94 v19.37,46.04
MORPH_IN3
  Top 0.254: R65.2 18.72,31.07 18.72,28.27 17.78,27.34 17.78,16.51
  Top 0.305: C56.1 15.14,16.51 17.78,16.51 J4.P3
MORPH_IN4  (via drill 0.5)
  Top 0.254: v18.1,47.94 19.05,48.9 20,48.9 20.32,48.58 21.59,48.58 22.54,47.62 27.94,47.62 30.16,45.4 30.16,42.23 27.94,40.01 26.99,40.01 25.72,38.73 25.72,35.4 26.51,34.61 26.51,28.57 27.62,27.46 27.62,20 v28.26,19.37 | R34.2 18.26,44.48 18.26,45.88 v18.1,46.04 | C57.1 62.02,15.56 63.5,15.56 64.45,16.51 J8.P3
  Bottom 0.254: J8.P3 58.42,16.51 57.15,17.78 55.88,17.78 55.24,17.14 46.67,17.14 45.4,18.41 29.21,18.41 v28.26,19.37 | v18.1,47.94 v18.1,46.04
MORPH_IN5  (via drill 0.5)
  Top 0.254: v26.67,16.51 26.67,18.41 26.35,18.73 26.35,25.24 24.61,26.99 24.61,34.13 23.81,34.92 23.81,39.69 26.04,41.91 26.99,41.91 28.26,43.18 28.26,44.45 26.99,45.72 24.13,45.72 23.94,45.53 R32.2 | J6.P3 45.72,16.51 49.85,20.64 C54.1
  Bottom 0.254: J6.P3 43.5,16.51 42.86,17.14 34.92,17.14 33.02,15.24 31.75,15.24 30.48,16.51 v26.67,16.51
MORPH_IN6  (via drill 0.5)
  Top 0.254: R66.2 23.81,31.08 23.81,26.83 25.72,24.92 v25.72,18.1 25.72,16.51 24.19,14.98 C58.1
  Bottom 0.254: v25.72,18.1 26.35,18.1 27.3,17.14 30.8,17.14 31.43,16.51 J5.P3
MORPH_IN7  (via drill 0.5)
  Top 0.254: v29.21,20.32 28.26,21.27 28.26,27.78 27.15,28.89 27.15,34.77 26.19,35.72 26.19,38.26 27.3,39.37 28.26,39.37 30.8,41.91 30.8,45.72 28.26,48.26 22.86,48.26 21.91,49.21 20.64,49.21 20.32,49.53 18.73,49.53 18.1,48.9 16.99,48.9 13.21,45.12 R33.2 | J2.P3 83.5,28.26 v83.5,17.78
  Top 0.305: C45.1 85.94,31.11 J2.P3
  Bottom 0.254: v83.5,17.78 67.94,17.78 67.31,17.14 58.74,17.14 57.47,18.41 55.56,18.41 54.93,17.78 46.99,17.78 45.72,19.05 30.48,19.05 v29.21,20.32
N$1
  Top 0.254: SW1.L1 20.32,99.61 R1.2
N$2
  Top 0.254: R5.2 78.66,96.16 SW2.L1
N$3
  Top 0.254: R55.1 46.16,32.74 46.02,32.88 IC9.12
N$4
  Top 0.406: IC3.3 12.06,76.05 12.06,76.99 13.78,78.71 C14.1 14.82,78.74 L3.1
N$5
  Top 0.254: R71.1 19.97,29.84 R65.1 R58.2 C41.1 IC6.2
N$6  (via drill 0.6)
  Top 0.406: L2.2 16.89,85.47 15.56,84.14 L3.2
  Top 0.61: v19.68,91.12 19.05,90.49 13.34,90.49 12.89,90.94 C5.1 12.68,92.29 L1.1 | L2.2 17.05,86.68 v19.68,86.68 | v23.18,96.52 | v23.18,96.52 D1.C
  Bottom 0.61: v19.68,86.68 v19.68,91.12 23.18,94.61 v23.18,96.52
N$7
  Top 0.254: R7.1 53.66,89.66 53.66,88.27 52.37,86.97 IC2.6
N$8
  Top 0.254: R8.1 54.77,88.74 52.87,86.84 IC2.5
N$9
  Top 0.254: LED3.3 24.45,61.91 R19.2
N$10
  Top 0.406: L4.2 8.8,73.03 D2.A
N$11
  Top 0.254: R70.1 15.08,30.16 14.73,30.52 R64.1 R57.2 C40.1 14.42,33.97 IC5.2
N$12
  Top 0.254: LED3.1 28.29,63.85 R18.2
N$13
  Top 0.254: IC2.47 54.37,72.31 54.61,72.07 C20.1
N$14  (via drill 0.5)
  Top 0.254: v37.31,15.56 37.47,15.72 37.47,16.51 37.94,16.99 37.94,18.1 | 37.94,18.1 37.94,18.73 | 40.6,34.17 40.64,34.13 | 37.94,18.1 37.94,21.11 39.37,22.54 39.37,27.46 40.96,29.05 40.96,30.16 40.96,33.66 40.96,33.81 40.6,34.17 | 13.65,12.38 | 13.65,12.38 v13.97,12.7 | R85.2 | R85.2 13.65,12.38 | 40.6,34.17 R51.1 | IC9.1 40,34.17 40.6,34.17
  Bottom 0.254: v13.97,12.7 15.56,14.29 26.35,14.29 27.62,15.56 30.16,15.56 31.43,14.29 33.34,14.29 34.29,15.24 34.61,15.24 | 34.61,15.24 35.08,15.24 | v37.31,15.56 36.99,15.24 34.61,15.24
N$15
  Top 0.254: R72.1 22.58,29.84 R66.1 R59.2 C42.1 IC6.6
N$16
  Top 0.254: LED1.3 3.85,86.96 R9.2
N$17
  Top 0.254: R28.1 16.99,44.48 R34.1 R40.2 C31.1 IC5.9
N$18
  Top 0.254: LED2.3 81.31,86.96 R11.2
N$19
  Top 0.254: C15.1 43.74,75.81 IC2.31
N$20
  Top 0.254: LED2.1 85.06,86.96 R12.2
N$21
  Top 0.254: LED4.3 61.91,63.5 63.18,64.77 R15.2
N$22
  Top 0.254: LED1.1 7.58,86.96 R10.2
N$23
  Top 0.254: LED4.1 65.37,64.17 R17.2
N$24
  Top 0.254: J10.P3 10.16,1.91 13.65,5.4 R85.1
N$25
  Top 0.254: C30.1 R39.2 R33.1 15.68,44.45 R30.1 | C30.1 14.45,41.88 | IC5.13 C30.1
N$26
  Top 0.254: R50.1 R51.2 39.41,34.96 39.05,34.61 39.05,33.81 39.34,33.53 IC9.2
N$27
  Top 0.254: R29.1 20.64,44.48 R35.1 R41.2 C32.1 20,41.31 19.97,41.28 IC6.13
N$28
  Top 0.254: LED6.2 2.86,12.06 R82.2
N$29
  Top 0.254: R56.1 39.25,32.74 39.37,32.86 39.38,32.88 IC9.3
N$30
  Top 0.254: IC9.7 IC9.6
N$31
  Top 0.254: 23.18,44.48 R32.1 R31.1 21.91,43.22 R42.2 C33.1 22.54,41.31 22.57,41.28 IC6.9
N$32
  Top 0.61: C3.1 12.78,94.19 L1.2 8.37,94.19 7.3,95.25 IC1.1
N$33
  Top 0.254: R2.1 51.75,97.47 53.5,99.22 60.8,99.22 JP2.2
N$34  (via drill 0.5)
  Top 0.254: v39.37,15.4 39.37,15.56 39.37,15.72 39.37,16.51 38.89,16.99 38.89,17.14 38.89,20.8 40.32,22.23 40.32,27.15 41.91,28.73 41.91,29.84 41.91,33.81 41.91,35.08 42.39,35.56 | 42.39,35.56 | 42.39,35.56 44.13,35.56 44.29,35.4 44.45,35.4 R52.1 44.77,35.37 44.77,34.92 45.42,34.27 IC9.14 | v26.04,12.7 25.72,12.38 R86.2
  Bottom 0.254: v26.04,12.7 27.94,14.61 29.84,14.61 31.11,13.34 33.66,13.34 34.45,14.13 37.62,14.13 38.1,14.13 v39.37,15.4
N$35
  Top 0.254: R49.1 R52.2 46,34.96 46.35,34.61 46.35,33.81 46.07,33.53 IC9.13
N$36  (via drill 0.5)
  Top 0.254: J9.P3 79.69,16.51 73.98,22.23 v73.98,22.54 | v35.4,23.02 35.72,23.34 35.72,25.88 34.92,26.67 34.92,33.18 37.31,35.56 37.31,41.91 38.1,42.7 38.1,46.83 40.13,48.86 R27.1
  Bottom 0.254: v73.98,22.54 73.66,22.86 67.94,22.86 66.04,24.77 59.05,24.77 57.15,22.86 55.88,22.86 53.98,24.77 46.99,24.77 45.09,22.86 43.81,22.86 41.91,24.77 37.15,24.77 v35.4,23.02
N$37
  Top 0.254: R67.1 46.16,31.71 46.02,31.58 IC9.10
N$38  (via drill 0.5)
  Top 0.254: R87.2 26.99,5.71 26.99,7.3 27.94,8.26 v34.92,8.26 | v41.27,15.24 41.27,21.27 43.18,23.18 43.18,29.21 44.25,30.28 IC9.8 45.42,29.54 R69.1
  Bottom 0.254: v34.92,8.26 38.58,11.91 38.58,13.02 39.53,13.97 40.16,13.97 | 40.16,13.97 | 40.16,13.97 | 40.16,13.97 41.27,15.08 v41.27,15.24
N$39
  Top 0.254: J11.P3 22.86,1.91 24.77,3.81 25.72,4.76 R86.1 25.5,6.45
N$40
  Top 0.254: R87.1 27.09,2.86 27.62,2.86 28.57,1.91 J12.P3
N$41
  Top 0.254: R75.1 R69.2 46.64,29.72 46.35,30 46.35,30.48 45.91,30.93 IC9.9
N$42
  Top 0.254: LED5.1 | LED5.1 R36.2
N$44
  Top 0.254: LED7.2 14.92,12.06 R83.2
N$45  (via drill 0.5)
  Top 0.254: v66.99,31.11 65.94,31.11 R62.2 65.69,31.5 C43.2 66.18,33.2 IC7.7 | v50.01,29.84 50.63,30.46 IC10.5
  Bottom 0.254: v66.99,31.11 66.67,30.8 63.82,30.8 62.87,29.84 v50.01,29.84
N$46
  Top 0.254: J9.P2 76.52,24.13 76.23,23.85 R77.2
N$47
  Top 0.254: J3.P2 9.21,24.13 10.51,25.43 R76.2
N$48
  Top 0.254: LED8.2 26.99,12.06 R84.2
N$49
  Top 0.254: 69.22,1.91 J15.P3 78.74,1.91 80.01,3.17 83.5,3.17 84.77,4.45 84.77,12.7 82.87,14.61 79.85,14.61 72.07,22.38 72.07,27.62 68.9,30.8 68.9,33.34 68.58,33.66 68.58,35.24 69.22,35.88 69.22,37.78 69.64,38.2 R46.1 69.53,39.16 69.53,39.69 70.01,40.16 71.91,40.16 72.39,39.69 R44.1
N$50
  Top 0.254: R24.2 R26.2 | R24.2 35.4,50.52 D4.C | Q2.B 34.92,51.44 35.44,50.92 R24.2
N$51
  Top 0.254: R3.1 52.86,97.31 53.34,97.79 JP2.1
N$52
  Top 0.254: D5.C 37.82,50.48 R25.2 | R25.2 R27.2 | Q3.B 38.42,51.44 38.93,50.92 R25.2
N$53
  Top 0.254: 44.47,1.89 J13.P3 54.61,1.91 55.88,3.17 57.15,3.17 57.78,2.54 66.36,2.54 67.63,3.81 69.53,3.81 70.17,3.17 78.11,3.17 79.38,4.45 82.87,4.45 83.5,5.08 83.5,12.06 82.23,13.34 79.53,13.34 70.8,22.07 70.8,26.99 67.63,30.16 64.61,30.16 63.92,30.85 R62.1 63.88,31.47 R60.1
N$54
  Top 0.254: R44.2 C35.1 73.62,37.91 73.03,37.31 73.03,36.87 R48.1 73.03,36.86 IC7.13
N$56
  Top 0.61: JP4.9 JP4.10 25.4,102.87 24.77,102.23 D1.A
N$57  (via drill 0.5)
  Top 0.254: J3.P3 13.34,21.59 v13.34,25.4 | v34.77,24.29 34.92,24.45 | 34.92,24.45 | 34.92,24.45 34.92,25.72 34.29,26.35 34.29,33.18 36.83,35.72 36.83,42.07 37.62,42.86 37.62,45.24 36.64,46.23 R26.1
  Bottom 0.254: v13.34,25.4 13.97,24.77 18.41,24.77 19.05,24.13 19.05,23.5 19.68,22.86 20.95,22.86 22.86,24.77 30.48,24.77 31.11,24.13 31.11,23.5 31.75,22.86 33.34,22.86 v34.77,24.29
N$58
  Top 0.254: J16.P3 80.96,1.91 81.6,2.54 83.82,2.54 85.41,4.13 85.41,13.02 83.19,15.24 80.01,15.24 72.71,22.54 72.71,30.16 73.72,31.17 R63.1 73.75,31.47 R61.1
N$59
  Top 0.254: 74.89,32.7 R61.2 73.34,32.67 C44.1 73.31,33.37 73.03,33.66 73.03,34.26 R53.1 73.03,34.26 IC7.9
N$60
  Top 0.254: R43.2 C34.1 64.17,37.91 64.77,37.31 64.77,36.94 64.81,36.9 R47.1 64.77,36.86 IC7.2
N$61
  Top 0.254: R60.2 62.9,32.7 C43.1 64.45,32.74 64.89,33.18 R54.1 65.34,34.26 IC7.6
N$62
  Top 0.254: R8.2 56.83,88.74 57.47,89.38 57.47,93.34 58.35,94.23 Q1.3 59.07,94.26 C4.2
N$63
  Top 0.254: 56.5,1.89 J14.P3 66.67,1.91 67.94,3.17 69.22,3.17 69.85,2.54 78.42,2.54 79.69,3.81 83.19,3.81 84.14,4.76 84.14,12.38 82.55,13.97 79.69,13.97 71.44,22.23 71.44,27.3 68.26,30.48 68.26,33.02 67.94,33.34 67.94,35.56 68.58,36.2 68.58,37.78 68.16,38.2 R45.1 68.26,39.16 68.26,39.69 67.79,40.16 66.04,40.16 65.56,39.69 R43.1
N$64
  Top 0.406: D2.C 2.54,73.03 1.59,73.98 1.59,90.17 5.08,93.66 5.08,102.87 6.99,104.78 8.26,104.78 35.56,104.78 36.83,103.5 JP4.2 JP4.1
N$65
  Top 0.254: C6.2 53.06,91.83 Q1.1 54.63,90.78 54.93,90.49 54.93,89.73 R7.2
N$67
  Top 0.254: R78.1 LED9.2 40.64,12.7 41.91,13.97 44.13,13.97 50.8,20.64 50.8,29.37 51.25,29.82 IC10.6
N$68
  Top 0.254: LED9.1 42.86,13.34 44.45,13.34 51.44,20.32 51.44,28.89 51.44,29.05 51.55,29.16 IC10.7
N$70  (via drill 0.5)
  Top 0.254: v51.91,33.97 51.59,33.97 51.12,33.5 51.12,32.07 51.42,31.77 IC10.3 | R45.2 66.18,38.77 66.18,38.26 | C34.2 65.53,38.26 66.18,38.26 | 66.18,38.26 IC7.1 66.95,37.51 v67.63,36.83
  Bottom 0.254: v67.63,36.83 67.31,36.51 64.45,36.51 61.28,33.34 52.55,33.34 v51.91,33.97
N$71
  Top 0.254: LED10.2 R79.1 50.13,13.3 52.07,15.24 52.07,27.94 53.18,29.05 53.18,32.07 52.83,32.41 IC10.2
N$72
  Top 0.254: LED10.1 53.34,12.7 52.7,13.34 52.7,27.62 53.82,28.73 53.82,32.38 53.14,33.06 IC10.1
N$73  (via drill 0.5)
  Top 0.254: v59.85,34.29 58.58,33.02 58.58,32.07 58.28,31.77 IC10.12 | R46.2 71.61,38.77 71.61,38.26 | 71.61,38.26 IC7.14 70.85,37.51 v70.17,36.83 | C35.2 72.27,38.26 71.61,38.26
  Bottom 0.254: v59.85,34.29 61.28,34.29 64.14,37.15 66.67,37.15 67.31,37.78 68.26,37.78 69.22,36.83 v70.17,36.83
N$74
  Top 0.254: LED11.2 R80.1 62.2,13.37 61.91,13.65 61.59,13.65 57.78,13.65 57.15,14.29 55.88,14.29 53.98,16.19 53.98,19.37 53.98,25.72 53.98,26.99 56.36,29.37 56.36,32.07 56.7,32.41 IC10.13
N$75
  Top 0.254: LED11.1 66.04,12.38 65.41,11.75 58.74,11.75 56.83,13.65 55.56,13.65 53.34,15.88 53.34,26.04 53.34,27.3 55.72,29.69 55.72,32.38 56.4,33.06 IC10.14
N$76  (via drill 0.5)
  Top 0.254: v70.64,30.8 71.28,31.43 R63.2 72.11,31.52 C44.2 71.61,33.2 IC7.8 | v60.48,28.57 58.59,30.46 IC10.10
  Bottom 0.254: v60.48,28.57 61.12,29.21 63.18,29.21 64.14,30.16 67.31,30.16 68.58,31.43 70.01,31.43 v70.64,30.8
N$77
  Top 0.254: LED12.2 R81.1 74.26,13.37 73.98,13.65 71.75,13.65 70.8,14.61 70.8,16.83 69.22,18.41 66.36,18.41 58.58,26.19 58.58,29.53 58.29,29.82 IC10.9
N$78
  Top 0.254: LED12.1 78.42,12.38 77.79,11.75 71.12,11.75 68.9,13.97 62.55,13.97 62.23,14.29 58.1,14.29 57.47,14.92 56.2,14.92 55.88,15.24 54.61,16.51 54.61,20.32 54.61,26.04 54.61,26.67 57.1,29.16 IC10.8
NORMALIZATION_PROBE  (via drill 0.5)
  Top 0.254: R76.1 v13.34,26.67 | v33.97,25.4 33.66,25.72 33.66,33.18 35.24,34.77 35.88,35.4 36.35,35.88 36.35,38.58 | IC2.39 50.37,67.42 50.8,66.99 50.8,65.56 48.58,63.34 48.58,57.78 47.94,57.15 33.5,57.15 33.34,56.99 D3.3 33.34,52.86 32.86,52.39 32.86,49.37 37.15,45.09 37.15,43.02 36.35,42.23 36.35,38.58 | v75.25,26.35 R77.1 | 36.35,38.58
  Bottom 0.254: v13.34,26.67 14.61,25.4 v33.97,25.4 74.3,25.4 v75.25,26.35
RESET
  Top 0.254: IC2.7 51.91,84.95 51.91,84.14 52.39,83.66 54.93,83.66 57.31,86.04 57.78,86.04 60.33,88.58 63.82,88.58 66.04,90.81 66.64,90.81 R6.1 C7.1 67.66,90.81 74.61,90.81 77.15,88.27 JP1.4
RX  (via drill 0.5)
  Top 0.254: v52.7,90.49 52.07,91.12 52.07,94.46 52.86,95.25 R3.2 | v52.07,77.47 52.37,77.17 IC2.43
  Bottom 0.254: v52.7,90.49 52.7,89.22 51.44,87.95 51.44,78.11 v52.07,77.47
SW_T_DV  (via drill 0.5)
  Top 0.254: SW1.P2 SW1.P5 16.39,96.04 18.89,96.04 25.08,89.85 35.24,89.85 36.51,88.58 v36.51,88.27 | v37.47,73.82 37.62,73.98 39.53,73.98 | 39.53,73.98 | 39.53,73.98 41.86,76.31 IC2.30
  Bottom 0.254: v36.51,88.27 36.51,87 36.83,86.68 36.83,74.45 v37.47,73.82
SW_T_MODE  (via drill 0.5)
  Top 0.254: IC2.35 48.37,71.23 47.62,70.48 36.71,70.48 36.39,70.48 35.4,70.48 34.92,70.96 v34.92,72.07 | v33.66,87.31 33.34,87.63 33.02,87.95 24.13,87.95 19.37,87.95 12.06,87.95 11.75,87.63 10.48,86.36 9.53,85.41 9.53,81.6 8.26,80.33 5.08,80.33 3.49,80.33 3.45,80.37 3.45,80.96 | 3.45,80.96 SW3.3 | SW3.4 3.45,80.96
  Bottom 0.254: v34.92,72.07 34.92,81.92 34.92,85.57 33.66,86.84 v33.66,87.31
SW_T_RANGE  (via drill 0.5)
  Top 0.254: SW5.3 SW5.4 | v26.67,65.41 27.3,66.04 29.84,66.04 33.02,69.22 35.88,69.22 36.51,69.85 37.15,69.85 47.94,69.85 48.87,70.78 IC2.36
  Bottom 0.254: SW5.4 26.67,57.51 v26.67,65.41
SW_X_DV
  Top 0.254: 53.34,85.02 IC2.4 53.37,85.91 54.77,87.31 57.31,87.31 59.85,89.85 61.91,89.85 62.23,90.17 62.23,91.76 64.45,93.98 71.12,93.98 73.66,96.52 SW2.P5 SW2.P2
SW_X_EXT
  Top 0.254: SW7.3 SW7.4 50.08,53.42 51.91,55.24 51.91,62.23 55.56,65.88 60.33,65.88 61.28,66.83 61.28,71.75 61.75,72.23 61.75,74.45 58.42,77.79 57.07,77.79 IC2.54
SW_X_MODE
  Top 0.254: IC2.2 54.37,86.12 55.09,86.84 57.63,86.84 60.01,89.22 63.66,89.22 65.88,91.44 74.93,91.44 84.45,91.44 86.68,89.22 86.68,83.19 85.48,81.99 SW4.4 SW4.3
SW_X_RANGE
  Top 0.254: IC2.58 60.21,79.81 60.8,79.22 70.96,79.22 | SW6.4 67.59,55.52 68.58,56.52 68.58,60.96 67.31,62.23 67.31,68.58 72.07,73.34 72.07,78.11 70.96,79.22 | 70.96,79.22
  Bottom 0.254: SW6.3 SW6.4
SWCLK  (via drill 0.5)
  Top 0.254: IC2.49 58.04,75.31 58.42,74.93 v58.42,74.3 | v65.09,85.72 65.41,85.41 66.67,85.41 66.99,85.09 72.07,85.09 73.34,83.82 JP1.3
  Bottom 0.254: v58.42,74.3 60.01,74.3 60.64,74.93 60.64,75.25 65.09,79.69 v65.09,85.72
SWDIO  (via drill 0.5)
  Top 0.254: v59.37,73.34 58.1,73.34 56.83,74.61 54.29,74.61 53.87,74.19 IC2.46 | v66.04,84.45 72.07,84.45 75.25,81.28 JP1.2
  Bottom 0.254: v59.37,73.34 59.69,73.66 60.33,73.66 61.28,74.61 61.28,74.93 65.72,79.38 65.72,83.19 66.04,83.5 v66.04,84.45
T_CLOCK
  Top 0.254: IC2.40 50.87,67.56 51.28,67.15 51.28,65.41 49.05,63.18 49.05,57.63 48.1,56.67 36.35,56.67 35.91,56.23 R22.1 35.91,54.32 Q2.C
TX  (via drill 0.5)
  Top 0.254: v51.75,89.53 51.44,89.85 51.44,94.61 51.75,94.93 R2.2 | v50.8,77.15 51.87,76.08 IC2.42
  Bottom 0.254: v51.75,89.53 50.8,88.58 v50.8,77.15
VCC  (via drill 0.5, 0.6)
  Top 0.254: IC7.4 v64.77,35.56 64.14,34.92 C39.1 | v49.21,32.7 49.21,31.75 49.81,31.15 C48.1 50.36,31.11 IC10.4 | 38.29,31.75 C50.1 | IC9.4 39.21,32.23 38.73,31.75 38.29,31.75 | 38.29,31.75 37.62,31.75 37.15,32.23 v37.15,32.7
  Top 0.406: v4.13,33.02 4.13,33.66 3.17,34.61 3.17,56.2 10.79,63.82 10.79,75.25 8.89,77.15 8.89,79.38 10.79,81.28 10.79,84.45 12.21,85.87 C11.+ 14.33,85.87 L2.1
  Bottom 0.406: v4.13,33.02 9.21,33.02 9.53,32.7 v37.15,32.7 v49.21,32.7 61.91,32.7 v64.77,35.56
VEE  (via drill 0.5)
  Top 0.254: IC7.11 v73.03,35.56 C37.2 | 57.5,31.1 IC10.11 59.5,31.11 C49.2 59.57,31.11 60.33,31.11 v60.96,31.75 | R68.1 31.43,30.2 v31.43,31.43
  Top 0.406: v2.86,32.07 2.86,33.66 2.22,34.29 2.22,57.47 1.59,58.1 1.59,59.69 8.08,66.19 C22.- 8.08,69.25 L4.1
  Bottom 0.305: 7.3,32.07 7.62,32.38 8.89,32.38 9.53,31.75
  Bottom 0.406: v2.86,32.07 7.3,32.07 | 9.53,31.75 31.43,31.75 | 31.43,31.75 v31.43,31.43 | 31.43,31.75 v60.96,31.75 62.23,31.75 66.04,35.56 v73.03,35.56
VREF  (via drill 0.5)
  Top 0.254: v69.85,42.23 70.17,41.91 74.3,41.91 77.15,39.05 77.15,32.7 77.75,32.1 R74.2 | v67.31,41.27 66.67,41.91 66.67,44.77 56.83,54.61 56.83,59.69 56.55,59.97 C25.1 56.5,60.85 IC4.3
  Bottom 0.254: v67.31,41.27 68.26,42.23 v69.85,42.23
VREF_BIAS  (via drill 0.5)
  Top 0.254: v67.31,32.7 67.31,34.92 | v70.48,32.7 70.48,34.92 | 70.48,34.92 70.48,35.88 70.82,36.21 IC7.12 | 67.31,34.92 67.31,35.88 66.98,36.21 IC7.3 | R74.1 R73.2 C51.1 75.21,30.45 76.2,31.43 v76.2,32.7 | IC7.5 66.19,34.92 67.31,34.92 | 70.48,34.92 70.5,34.91 IC7.10
  Bottom 0.254: v67.31,32.7 v70.48,32.7 v76.2,32.7
X_CLOCK
  Top 0.254: IC2.41 51.37,67.69 51.75,67.31 51.75,65.25 49.53,63.02 49.53,57.47 48.26,56.2 40.16,56.2 39.85,55.88 R23.1 39.34,54.32 Q3.C

## Text on the board
bNames: Red Stripe | +12V | GND | GND | GND | -12V | Marbles | cc-by-sa Émilie Gillet | 2017. v7
tStop: Marbles | cc-by-sa Émilie Gillet | 2017. v7